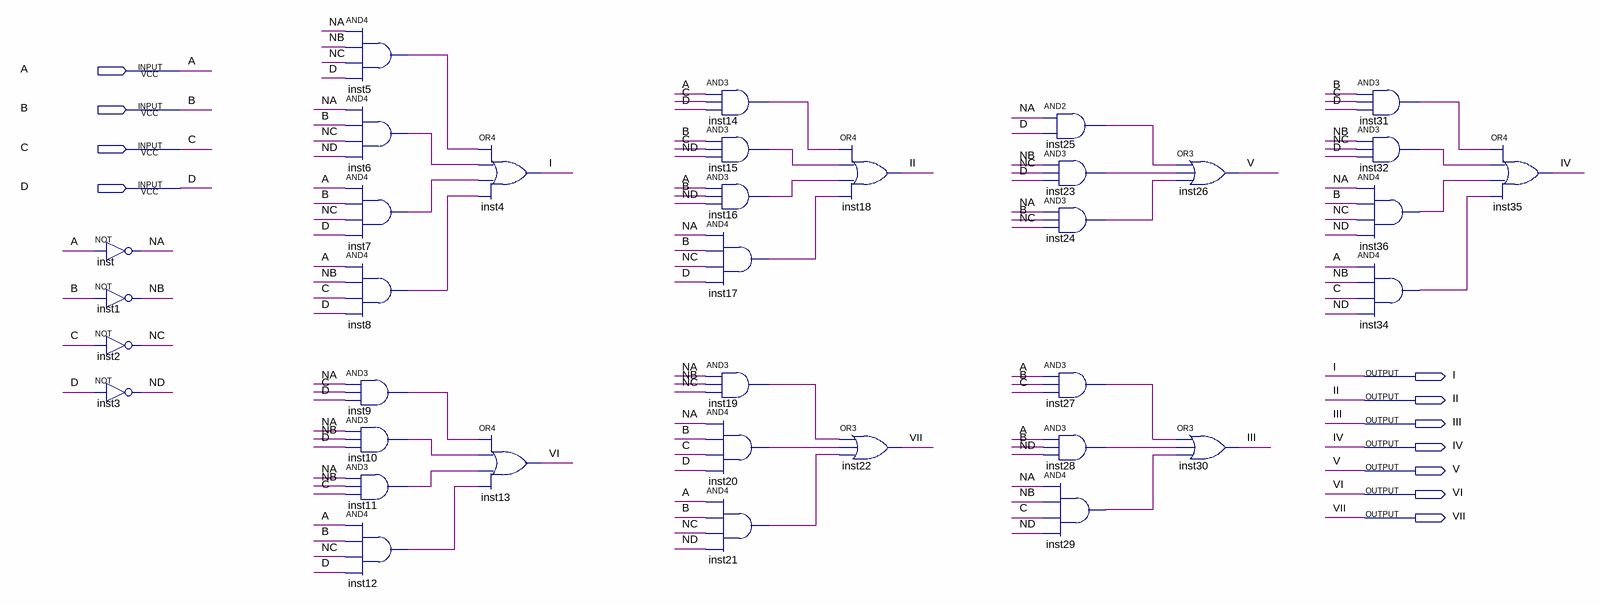
[diagram p0: schematic sheet]
// Quartus schematic display.bdf as structural Verilog: 36 symbols, 11 pins
module display (
  input  A,
  input  B,
  input  C,
  input  D,
  output I,
  output II,
  output III,
  output IV,
  output V,
  output VI,
  output VII
);

  wire inst5_out, inst6_out, inst7_out, inst8_out, inst9_out, inst10_out, inst11_out, inst12_out, inst14_out,
       inst15_out, inst16_out, inst17_out, inst19_out, inst20_out, inst21_out, inst23_out, inst24_out,
       inst25_out, inst27_out, inst28_out, inst29_out, inst31_out, inst32_out, inst34_out, inst36_out, NA,
       NB, NC, ND;

  not inst (NA, A);
  not inst1 (NB, B);
  not inst2 (NC, C);
  not inst3 (ND, D);
  and inst5 (inst5_out, NA, NB, NC, D);
  and inst6 (inst6_out, NA, B, NC, ND);
  and inst7 (inst7_out, A, B, NC, D);
  and inst8 (inst8_out, A, NB, C, D);
  and inst9 (inst9_out, NA, C, D);
  and inst10 (inst10_out, NA, NB, D);
  and inst11 (inst11_out, NA, NB, C);
  and inst12 (inst12_out, A, B, NC, D);
  or inst4 (I, inst5_out, inst6_out, inst7_out, inst8_out);
  or inst13 (VI, inst9_out, inst10_out, inst11_out, inst12_out);
  and inst14 (inst14_out, A, C, D);
  and inst15 (inst15_out, B, C, ND);
  and inst16 (inst16_out, A, B, ND);
  and inst17 (inst17_out, NA, B, NC, D);
  and inst19 (inst19_out, NA, NB, NC);
  and inst20 (inst20_out, NA, B, C, D);
  and inst21 (inst21_out, A, B, NC, ND);
  or inst18 (II, inst14_out, inst15_out, inst16_out, inst17_out);
  or inst22 (VII, inst19_out, inst20_out, inst21_out);
  and inst25 (inst25_out, NA, D);
  and inst23 (inst23_out, NB, NC, D);
  and inst24 (inst24_out, NA, B, NC);
  and inst27 (inst27_out, A, B, C);
  and inst28 (inst28_out, A, B, ND);
  and inst29 (inst29_out, NA, NB, C, ND);
  or inst26 (V, inst25_out, inst23_out, inst24_out);
  or inst30 (III, inst27_out, inst28_out, inst29_out);
  and inst31 (inst31_out, B, C, D);
  and inst32 (inst32_out, NB, NC, D);
  and inst36 (inst36_out, NA, B, NC, ND);
  and inst34 (inst34_out, A, NB, C, ND);
  or inst35 (IV, inst31_out, inst32_out, inst36_out, inst34_out);
endmodule
